# EAGLE schematic l-drv_h2-smd-001 (EAGLE 7.2.0)
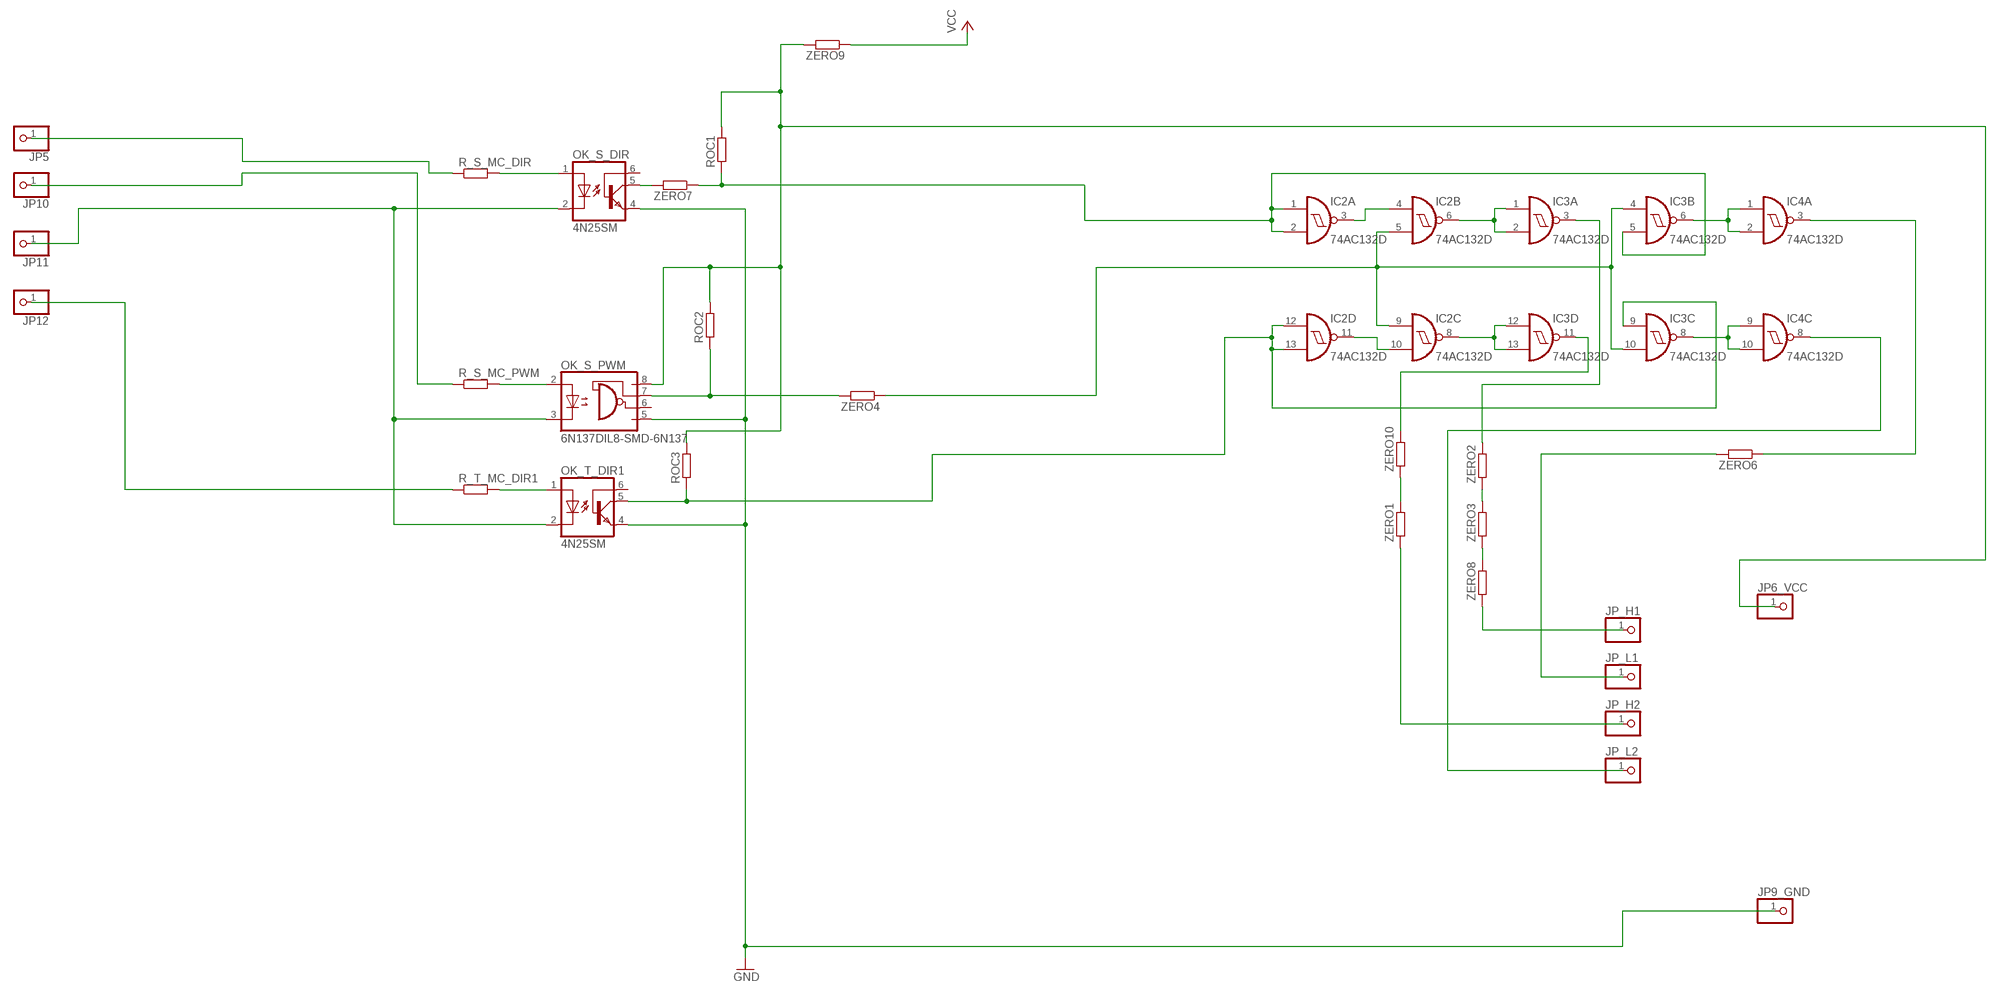
[diagram p0: schematic, sheet 1]

## Parts
IC2  74AC132D  [SO14]
IC3  74AC132D  [SO14]
IC4  74AC132D  [SO14]
JP5  PINHD-1X1  [1X01]
JP6_VCC  PINHD-1X1  [1X01]
JP9_GND  PINHD-1X1  [1X01]
JP10  PINHD-1X1  [1X01]
JP11  PINHD-1X1  [1X01]
JP12  PINHD-1X1  [1X01]
JP_H1  PINHD-1X1  [1X01]
JP_H2  PINHD-1X1  [1X01]
JP_L1  PINHD-1X1  [1X01]
JP_L2  PINHD-1X1  [1X01]
OK_S_DIR  4N25SM  [DIL6-SMD]
OK_S_PWM  6N137DIL8-SMD-6N137  [DIL8-SMD]
OK_T_DIR1  4N25SM  [DIL6-SMD]
R_S_MC_DIR  R-EU_R1206  [R1206]
R_S_MC_PWM  R-EU_R1206  [R1206]
R_T_MC_DIR1  R-EU_R1206  [R1206]
ROC1  R-EU_R1206  [R1206]
ROC2  R-EU_R1206  [R1206]
ROC3  R-EU_R1206  [R1206]
ZERO1  R-EU_R1206  [R1206]
ZERO2  R-EU_R1206  [R1206]
ZERO3  R-EU_R1206  [R1206]
ZERO4  R-EU_R1206  [R1206]
ZERO6  R-EU_R1206  [R1206]
ZERO7  R-EU_R1206  [R1206]
ZERO8  R-EU_R1206  [R1206]
ZERO9  R-EU_R1206  [R1206]
ZERO10  R-EU_R1206  [R1206]

## Nets
GND: JP9_GND.1 OK_S_DIR.4(EMI) OK_S_PWM.5(GND) OK_T_DIR1.4(EMI)
MC_GND: JP11.1 OK_S_DIR.2(C) OK_S_PWM.3(C) OK_T_DIR1.2(C)
N$1: OK_S_DIR.1(A) R_S_MC_DIR.2
N$2: OK_S_PWM.2(A) R_S_MC_PWM.2
N$3: OK_T_DIR1.1(A) R_T_MC_DIR1.2
N$4: IC3.3(A:O) ZERO2.2
N$5: IC2.3(A:O) IC2.4(B:I0)
N$6: JP5.1 R_S_MC_DIR.1
N$7: JP10.1 R_S_MC_PWM.1
N$8: JP12.1 R_T_MC_DIR1.1
N$9: IC2.10(C:I1) IC2.11(D:O)
N$10: ZERO1.2 ZERO10.1
N$11: IC2.6(B:O) IC3.1(A:I0) IC3.2(A:I1)
N$12: IC2.8(C:O) IC3.12(D:I0) IC3.13(D:I1)
N$13: JP_H2.1 ZERO1.1
N$14: JP_H1.1 ZERO8.1
N$15: IC3.11(D:O) ZERO10.2
N$16: ZERO2.1 ZERO3.2
N$17: IC4.3(A:O) ZERO6.1
N$18: IC4.8(C:O) JP_L2.1
N$19: IC3.6(B:O) IC4.1(A:I0) IC4.2(A:I1)
N$20: OK_S_PWM.7(VE) ROC2.1 ZERO4.2
N$21: IC3.8(C:O) IC4.9(C:I0) IC4.10(C:I1)
N$23: JP_L1.1 ZERO6.2
N$24: OK_S_DIR.5(COL) ZERO7.2
N$25: ZERO3.1 ZERO8.2
N$26: JP6_VCC.1 OK_S_PWM.8(VCC) ROC1.2 ROC2.2 ROC3.2 ZERO9.2
N$D1: IC2.1(A:I0) IC2.2(A:I1) IC3.5(B:I1) ROC1.1 ZERO7.1
N$D2: IC2.12(D:I0) IC2.13(D:I1) IC3.9(C:I0) OK_T_DIR1.5(COL) ROC3.1
N$PWM: IC2.5(B:I1) IC2.9(C:I0) IC3.4(B:I0) IC3.10(C:I1) ZERO4.1
VCC: ZERO9.1
Unconnected: IC4.4(B:I0) IC4.5(B:I1) IC4.6(B:O) IC4.11(D:O) IC4.12(D:I0) IC4.13(D:I1) OK_S_DIR.6(BAS) OK_S_PWM.6(VO) OK_T_DIR1.6(BAS)

## Power pins joined to a net without a drawn wire
GND: IC2.7(P:GND) IC3.7(P:GND) IC4.7(P:GND)
VCC: IC2.14(P:VCC) IC3.14(P:VCC) IC4.14(P:VCC)

## Library data of the parts
IC2-IC4 = 74xx-eu:74*132: Quad 2-input NAND schmitt trigger
JP5 JP6_VCC JP9_GND JP10-JP12 JP_H1 JP_H2 JP_L1 JP_L2 = pinhead:PINHD-1X1: PIN HEADER
OK_S_DIR OK_T_DIR1 = optocoupler:4N*?M: General Purpose 6-Pin Phototransistor Optocouplers Source: http://www.fairchildsemi.com/ds/4N/4N35-M.pdf; MF: FAIRCHILD SEMICONDUCTOR; MPN: 4N25SM; OC_FARNELL: 1021152; OC_NEWARK: 34C2020
OK_S_PWM = dbg-misc:6N137: MOTOROLA OPTO COUPLER
R_S_MC_DIR R_S_MC_PWM R_T_MC_DIR1 ROC1-ROC3 ZERO1-ZERO4 ZERO6-ZERO10 = rcl:R-EU_: RESISTOR, European symbol